# EasyEDA Pro project 4090_Portable_Fan.epro, schematic Schematic4
Board Name: 两节电池版本; Create Date: 2025-09-07; Page Name: P1; Project Name: 基于STC8G的风扇控制主板; Schematic Name: Schematic4; Update Date: 2025-09-07; Company: 嘉立创EDA; Page Size: A4; Version: V1.0
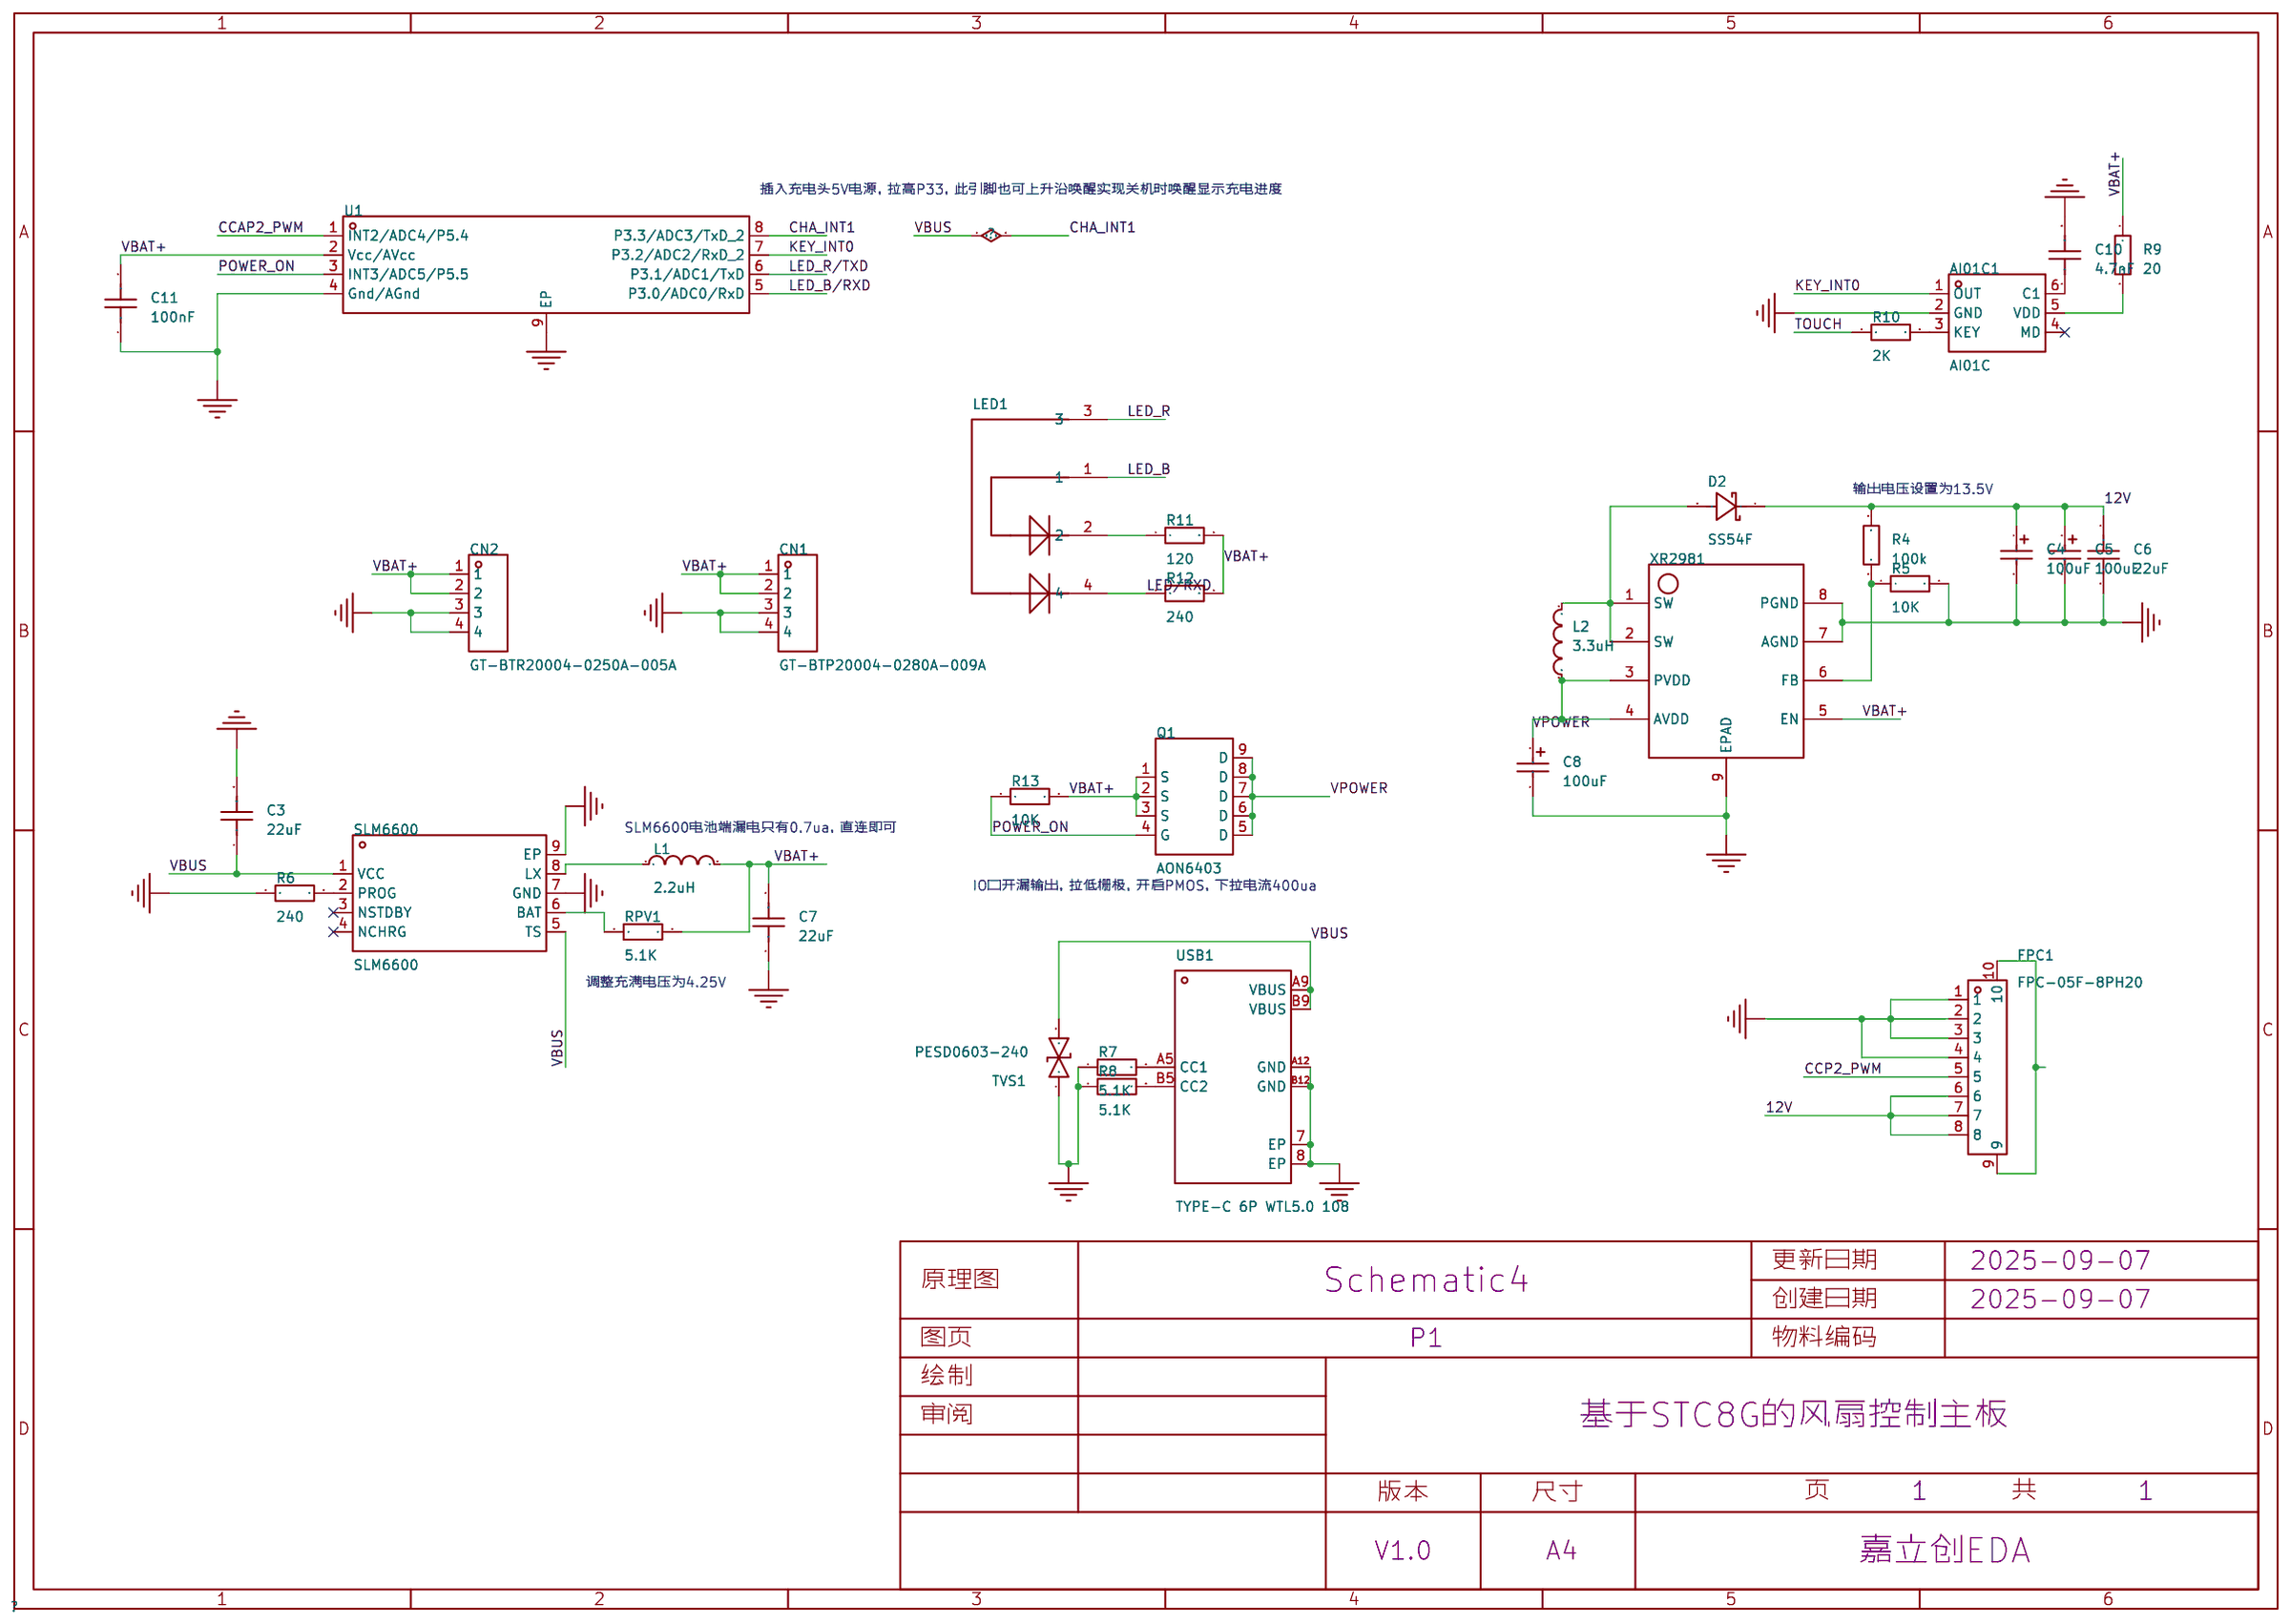
[diagram p4: schematic sheet]

## Parts
AI01C1  AI01C  [SOT-23-6_L2.9-W1.6-P0.95-LS2.8-BL]
C3  22uF  [C0805]
C4  100uF  [CASE-B_3528]
C5  100uF  [CASE-B_3528]
C6  22uF  [C0805]
C7  22uF  [C0805]
C8  100uF  [CASE-B_3528]
C10  4.7nF  [C0805]
C11  100nF  [C0603]
CN1  GT-BTP20004-0280A-009A  [CONN-TH_GT-BTP20004-0280A-009A]
CN2  GT-BTR20004-0250A-005A  [CONN-SMD_GT-BTR20004-0250A-005A]
D2  SS54F  [SMAF_L3.5-W2.6-LS4.7-RD-1]
FPC1  FPC-05F-8PH20  [FPC-SMD_8P-P0.50_FPC-05F-8PH20]
L1  2.2uH  [IND-SMD_L7.0-W6.6]
L2  3.3uH  [IND-SMD_L7.0-W6.6]
LED1  -  [1206 侧贴双色LED]
Q1  AON6403  [PDFN-8_L5.6-W5.2-P1.27-LS6.1-BL]
R4  100k  [R0603]
R5  10K  [R0603]
R6  240  [R0805]
R7  5.1K  [R0603]
R8  5.1K  [R0603]
R9  20  [R0805]
R10  2K  [R0805]
R11  120  [R0603]
R12  240  [R0603]
R13  10K  [R0603]
RPV1  5.1K  [R0805]
SLM6600  SLM6600  [SOP-8_L4.9-W3.9-P1.27-LS6.0-BL-EP]
TVS1  PESD0603-240  [D0603-BI]
U1  STC8G1K08A-36I-DFN8  [DFN-8_L3.0-W3.0-P0.50-BL-EP]
USB1  TYPE-C 6P WTL5.0 108  [USB-C-SMD_TYPE-C-6P-WTL5.0-108]
XR2981  -  [ESOP-8_L4.9-W3.9-P1.27-LS6.0-TL-EP3.3]

## Library data of the parts
AI01C1 = AI01C: 通道数:1;; LCSC Part Name: 单通道触摸芯片; Supplier Part: C2943977; Manufacturer: Sam&wing(芯网); Supplier Footprint: SOT-23-6L; JLCPCB Part Class: 扩展库; Datasheet: https://atta.szlcsc.com/upload/public/pdf/source/20220822/7FBF328F0E1B91F043D74B98771C088B.pdf; Supplier: LCSC; The Channel Number: 1
C3 C6 C7 C10 C11 = CAP_0603: Supplier Footprint: 0603
C4 C5 C8 = TAJB106K016RNJ: 容值:10uF;精度:±10%;额定电压:16V;等效串联电阻(ESR):2.8Ω@100kHz;; LCSC Part Name: 10uF ±10% 16V; Supplier Part: C7193; Manufacturer: Kyocera AVX; Supplier Footprint: CASE-B-3528-21(mm); JLCPCB Part Class: 扩展库; Supplier: LCSC; Tolerance: ±10%; Voltage Rating: 16V; Equivalent Series Resistance(ESR): 2.8Ω@100kHz; Operating Temperature: -55℃~+125℃
CN1 = GT-BTP20004-0280A-009A: 刀片电池公座/插接2.0间距/4PIN/塑高2.8/SMT有柱/4A; LCSC Part Name: 立式Pitch2.0 4P电池公座; Supplier Part: C29780051; Manufacturer: G-Switch(品赞); Supplier Footprint: 插件,P=2mm; JLCPCB Part Class: 扩展库; Datasheet: https://atta.szlcsc.com/upload/public/pdf/source/20240802/BAA7DE6A9C3103806FD8D697C86A5FC4.pdf; Supplier: LCSC; Connect Type: 刀片接触型(公); Pitch: 2mm; Number of Pins: 4P; Mounting Style: 立贴; Current Rating (Max): 4A; Voltage Rating (Max): 20V; Contact Material: 磷青铜; Contact Plating: 金; Operating Temperature Range: -40℃~+85℃
CN2 = GT-BTR20004-0250A-005A: 刀片电池母座/插接2.0间距/4PIN/塑高2.5/SMT有柱/4A; LCSC Part Name: 卧式Pitch2.0 4P电池母座; Supplier Part: C29780049; Manufacturer: G-Switch(品赞); Supplier Footprint: 插件,P=2mm; JLCPCB Part Class: 扩展库; Datasheet: https://atta.szlcsc.com/upload/public/pdf/source/20240802/6397B66360824D8B1E2E84EB4C77B31A.pdf; Supplier: LCSC; Connect Type: 刀片接触型(母); Pitch: 2mm; Number of Pins: 4P; Mounting Style: 立贴; Current Rating (Max): 4A; Voltage Rating (Max): 20V; Operating Temperature Range: -40℃~+85℃
D2 = SS54F_C18199179: 二极管配置:独立式;正向压降(Vf):550mV@5.0A;直流反向耐压(Vr):40V;整流电流:5A;; LCSC Part Name: 电压:40V 电流:5A; Supplier Part: C18199179; Manufacturer: 宏嘉诚; Supplier Footprint: SMAF; JLCPCB Part Class: Extended Part; Datasheet: https://atta.szlcsc.com/upload/public/pdf/source/20250121/FDB92513849E10B53DCF948A58635644.pdf; Supplier: LCSC; Diode Configuration: 独立式; Voltage - Forward(Vf@If): 550mV@5.0A; Voltage - DC Reverse(Vr): 40V; Current - Rectified: 5A; Reverse Leakage Current (Ir): 200uA@40V
FPC1 = FPC-05F-8PH20: 锁定特性:翻盖式;触点类型:下接;触点数量:8P;间距:0.5mm;安装类型:卧贴;工作温度范围:-25℃~+85℃;; LCSC Part Name: 间距:0.5mm P数:8P 翻盖式 下接; Supplier Part: C2856797; Manufacturer: XUNPU(讯普); Supplier Footprint: SMD,P=0.5mm,卧贴; JLCPCB Part Class: 扩展库; Datasheet: https://atta.szlcsc.com/upload/public/pdf/source/20210728/C2856796_EA80EFD10E16055FE067E7763B90421F.pdf; Supplier: LCSC; Locking Feature: 翻盖式; Contact Type: 下接; Number of Contacts: 8P; Pitch: 0.5mm; Mounting Type: 卧贴; FFC, FCB Thickness: 0.3mm; Height Above Board: 2mm; Operating Temperature Range: -25℃~+85℃
L1 L2 = FXL0630-2R2-M: 电感值:2.2uH;精度:±20%;额定电流:9.5A;饱和电流(Isat):10A;类型:一体成型电感;; LCSC Part Name: 2.2uH ±20% 10A; Supplier Part: C167218; Manufacturer: cjiang(长江微电); Supplier Footprint: SMD,6.6x7mm; JLCPCB Part Class: 扩展库; Datasheet: https://atta.szlcsc.com/upload/public/pdf/source/20240426/3189EA8206330E2108542F9E34E540E7.pdf; Supplier: LCSC; Tolerance: ±20%; Rated Current: 9.5A; Saturation Current (Isat): 10A; DC Resistance (DCR): 15mΩ; Type: 一体成型电感
LED1 = 1206侧发光LED
Q1 = AON6403: 数量:1个P沟道;漏源电压(Vdss):30V;连续漏极电流(Id):85A;导通电阻(RDS(on)):3.1mΩ@10V;耗散功率(Pd):-;阈值电压(Vgs(th)):2.2V@250uA;; LCSC Part Name: 1个P沟道 耐压:30V 电流:85A; Supplier Part: C2760089; Manufacturer: AOS; Supplier Footprint: DFN-8(5x6); JLCPCB Part Class: 扩展库; Datasheet: https://atta.szlcsc.com/upload/public/pdf/source/20240417/CECEFA73771F1A601B0FB499439FD37F.pdf; Supplier: LCSC; Number: 1个P沟道; Drain to Source Voltage: 30V; Current - Continuous Drain(Id): 85A; RDS(on): 3.1mΩ@10V; Gate Threshold Voltage (Vgs(th)): 2.2V@250uA; Gate Charge(Qg): 196nC@10V; Input Capacitance(Ciss): 9.12nF@15V; Reverse Transfer Capacitance (Crss@Vds): 1.47nF@15V; Operating Temperature: -55℃~+150℃
R4-R13 RPV1 = Res_0603: Supplier Footprint: 0603
SLM6600 = SLM6600: 工作电压:4V~6V;最大充电电流:3.5A;电池类型:锂离子/聚合物;电池节数:1;; Supplier Part: C130316; Manufacturer: 无锡松朗微; Supplier Footprint: SOP-8-EP; JLCPCB Part Class: 扩展库; Datasheet: https://atta.szlcsc.com/upload/public/pdf/source/20200723/C130316_33CFDDBAEF8892C90734B89DFA84F834.pdf; Supplier: LCSC; The Chip Type: 降压充电芯片; Supply Voltage: 4V~6V; Maximum Charge Current: 3.5A; Charging Saturation Voltage: 4.2V; Type of Battery: 锂离子/聚合物; Number of Cells: 1; Operating Temperature: -40℃~+85℃
TVS1 = PESD0603-240_C2929617: 钳位电压:45V;击穿电压:-;; Supplier Part: C2929617; Manufacturer: Littelfuse(美国力特); Supplier Footprint: 0603; JLCPCB Part Class: 扩展库; Datasheet: https://atta.szlcsc.com/upload/public/pdf/source/20180516/C207186_7CE2F9DCABF8CE4AA3105E54FFDB24F6.pdf; Supplier: LCSC; Clamping Voltage: 45V; Number of Channels: 单路; Type: ESD
U1 = STC8G1K08A-36I-DFN8: CPU内核:51系列;应用领域:-;; Supplier Part: C915664; Manufacturer: STC; Supplier Footprint: DFN-8-EP(3x3); JLCPCB Part Class: 扩展库; Datasheet: https://atta.szlcsc.com/upload/public/pdf/source/20241226/1556D7EB67C0BC8C1661C3E278549CA4.pdf; Supplier: LCSC; CPU Core: 51系列; Program Storage Size: 8KB; Program Memory Type: FLASH
USB1 = TYPE-C 6P WTL5.0 108: 连接器类型:Type-C;公母:母;安装方式:卧贴;触点数量:6P;端口数量:1;额定电流 - 电源:3A;工作温度范围:-20℃~+85℃;; LCSC Part Name: Type-C 母 卧贴; Supplier Part: C30167323; Manufacturer: SHOU HAN(首韩); Supplier Footprint: SMD; JLCPCB Part Class: 扩展库; Datasheet: https://atta.szlcsc.com/upload/public/pdf/source/20240719/5FA0E35FE16D69FE6470A929035FA38A.pdf; Supplier: LCSC; Connector Type: Type-C; Gender: 母; Mounting Style: 卧贴; Number of Contacts: 6P; Number of Ports: 1; Current Rating - Power (Max): 3A; Rated Voltage (Max): 5V; Connect-Disconnect Life: 5千次; Length: 5mm; Core Colour: 黑色; Operating Temperature Range: -20℃~+85℃
XR2981 = XR2981: ESOP8，输入12A，功率24W，升压ic

## Nets
12V: C4.1 C5.1 C6.1 D2.1(K) FPC1.6 FPC1.7 FPC1.8 R4.2
GND: AI01C1.2(GND) C3.2 C4.2 C5.2 C6.2 C7.1 C8.2 C10.2 C11.1 CN1.3 CN1.4 CN2.3 CN2.4 FPC1.1 FPC1.2 FPC1.3 FPC1.4 R5.2 R6.1 R7.1 R8.1 SLM6600.7(GND) SLM6600.9(EP) TVS1.1 U1.4(Gnd/AGnd) U1.9(EP) USB1.7(EP) USB1.8(EP) USB1.A12(GND) USB1.B12(GND) XR2981.7(AGND) XR2981.8(PGND) XR2981.9(EPAD)
VBAT+: C7.2 C11.2 CN1.1 CN1.2 CN2.1 CN2.2 L1.2 Q1.1(S) Q1.2(S) Q1.3(S) R9.1 R11.2 R12.2 R13.2 RPV1.2 U1.2(Vcc/AVcc) XR2981.5(EN)
CCAP2_PWM: U1.1(INT2/ADC4/P5.4)
CCP2_PWM: FPC1.5
CHA_INT1: C3.1 SLM6600.1(VCC) SLM6600.5(TS) TVS1.2 U1.8(P3.3/ADC3/TxD_2) USB1.A9(VBUS) USB1.B9(VBUS)
KEY_INT0: AI01C1.1(OUT) U1.7(P3.2/ADC2/RxD_2)
LED/RXD: LED1.4 R12.1
LED_B: LED1.1
LED_B/RXD: U1.5(P3.0/ADC0/RxD)
LED_R: LED1.3
LED_R/TXD: U1.6(P3.1/ADC1/TxD)
POWER_ON: Q1.4(G) R13.1 U1.3(INT3/ADC5/P5.5)
TOUCH: R10.1
VPOWER: C8.1 L2.1 Q1.5(D) Q1.6(D) Q1.7(D) Q1.8(D) Q1.9(D) XR2981.3(PVDD) XR2981.4(AVDD)
Net-(AI01C1-3): AI01C1.3(KEY) R10.2
Net-(AI01C1-5): AI01C1.5(VDD) R9.2
Net-(AI01C1-6): AI01C1.6(C1) C10.1
Net-(D2-2): D2.2(A) L2.2 XR2981.1(SW) XR2981.2(SW)
Net-(FPC1-9): FPC1.9 FPC1.10
Net-(L1-1): L1.1 SLM6600.8(LX)
Net-(LED1-2): LED1.2 R11.1
Net-(R4-1): R4.1 R5.1 XR2981.6(FB)
Net-(R6-2): R6.2 SLM6600.2(PROG)
Net-(R7-2): R7.2 USB1.A5(CC1)
Net-(R8-2): R8.2 USB1.B5(CC2)
Net-(RPV1-1): RPV1.1 SLM6600.6(BAT)

Not connected (* = marked no-connect by the designer): AI01C1 4(MD)*; SLM6600 3(NSTDBY)* 4(NCHRG)*

## Notes on the sheet
- 插入充电头5V电源，拉高P33，此引脚也可上升沿唤醒实现关机时唤醒显示充电进度
- 输出电压设置为13.5V
- SLM6600电池端漏电只有0.7ua，直连即可
- IO口开漏输出，拉低栅极，开启PMOS，下拉电流400ua
- 调整充满电压为4.25V
